# EAGLE design rpiInterface2 (EAGLE 9.4.2)
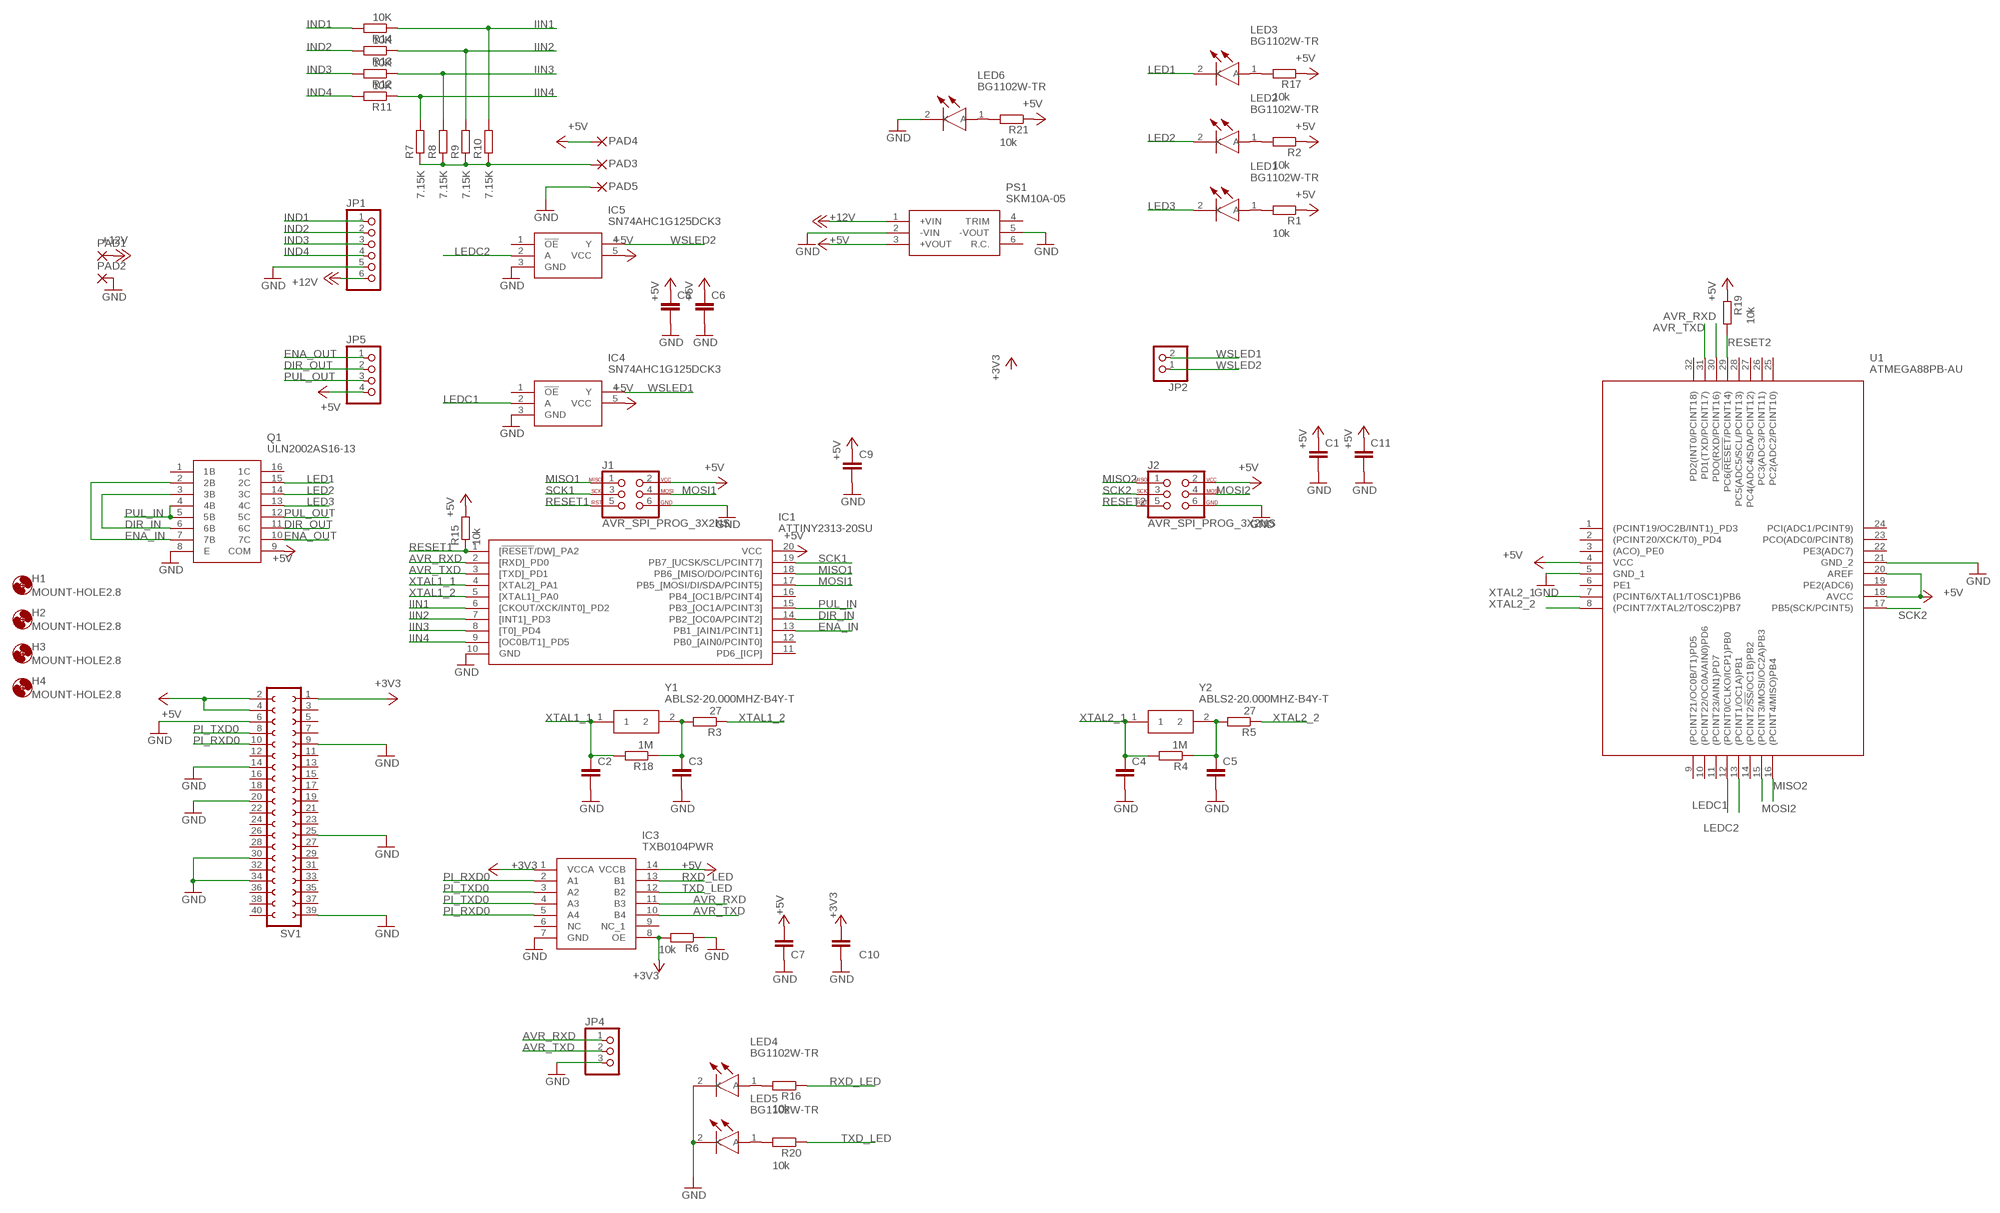
[diagram p0: schematic, sheet 1]

## Parts
C1  C-EUC1206  [C1206]
C2  C-EUC1206  [C1206]
C3  C-EUC1206  [C1206]
C4  C-EUC1206  [C1206]
C5  C-EUC1206  [C1206]
C6  C-EUC1206  [C1206]
C7  C-EUC1206  [C1206]
C8  C-EUC1206  [C1206]
C9  C-EUC1206  [C1206]
C10  C-EUC1206  [C1206]
C11  C-EUC1206  [C1206]
H1  MOUNT-HOLE2.8  [2,8]
H2  MOUNT-HOLE2.8  [2,8]
H3  MOUNT-HOLE2.8  [2,8]
H4  MOUNT-HOLE2.8  [2,8]
IC1  ATTINY2313-20SU  [SOIC127P1032X265-20N]
IC3  TXB0104PWR  [SOP65P640X120-14N]
IC4  SN74AHC1G125DCK3  [SOT65P210X110-5N]
IC5  SN74AHC1G125DCK3  [SOT65P210X110-5N]
J1  AVR_SPI_PROG_3X2NS  [2X3-NS]
J2  AVR_SPI_PROG_3X2NS  [2X3-NS]
JP1  PINHD-1X6  [1X06]
JP2  PINHD-1X2  [1X02]
JP4  PINHD-1X3  [1X03]
JP5  PINHD-1X4  [1X04]
LED1  BG1102W-TR  [BG1102WTR]
LED2  BG1102W-TR  [BG1102WTR]
LED3  BG1102W-TR  [BG1102WTR]
LED4  BG1102W-TR  [BG1102WTR]
LED5  BG1102W-TR  [BG1102WTR]
LED6  BG1102W-TR  [BG1102WTR]
PAD1  3,17/1,3  [3,17/1,3]
PAD2  3,17/1,3  [3,17/1,3]
PAD3  SMD2  [SMD1,27-2,54]
PAD4  SMD2  [SMD1,27-2,54]
PAD5  SMD2  [SMD1,27-2,54]
PS1  SKM10A-05  [SKM10A05]
Q1  ULN2002AS16-13  [SOIC127P605X126-16N]
R1  10k  R-EU_R1206  [R1206]
R2  10k  R-EU_R1206  [R1206]
R3  27  R-EU_R1206  [R1206]
R4  1M  R-EU_R1206  [R1206]
R5  27  R-EU_R1206  [R1206]
R6  10k  R-EU_R1206  [R1206]
R7  7.15K  R-EU_R1206  [R1206]
R8  7.15K  R-EU_R1206  [R1206]
R9  7.15K  R-EU_R1206  [R1206]
R10  7.15K  R-EU_R1206  [R1206]
R11  10K  R-EU_R1206  [R1206]
R12  10K  R-EU_R1206  [R1206]
R13  10K  R-EU_R1206  [R1206]
R14  10K  R-EU_R1206  [R1206]
R15  10k  R-EU_R1206  [R1206]
R16  10k  R-EU_R1206  [R1206]
R17  10k  R-EU_R1206  [R1206]
R18  1M  R-EU_R1206  [R1206]
R19  10k  R-EU_R1206  [R1206]
R20  10k  R-EU_R1206  [R1206]
R21  10k  R-EU_R1206  [R1206]
SV1  FE20-2  [FE20-2]
U1  ATMEGA88PB-AU  [QFP80P900X900X120-32N]
Y1  ABLS2-20.000MHZ-B4Y-T  [HC/49US-(AT49)_1]
Y2  ABLS2-20.000MHZ-B4Y-T  [HC/49US-(AT49)_1]

## Nets
+3V3: C10.1 IC3.1(VCCA) IC3.8(OE) R6.2 SV1.1
+5V: C1.1 C6.1 C7.1 C8.1 C9.1 C11.1 IC1.20(VCC) IC3.14(VCCB) IC4.5(VCC) IC5.5(VCC) J1.2 J2.2 JP5.4 PAD4.1(P) PS1.3(+VOUT) Q1.9(COM) R1.1 R2.1 R15.2 R17.1 R19.1 R21.1 SV1.2 SV1.4 U1.4(VCC) U1.18(AVCC) U1.20(AREF)
+12V: JP1.6 PAD1.1(P) PS1.1(+VIN)
AVR_RXD: IC1.2([RXD]_PD0) IC3.11(B3) JP4.1 U1.30(PDO(RXD/PCINT16))
AVR_TXD: IC1.3([TXD]_PD1) IC3.10(B4) JP4.2 U1.31(PD1(TXD/PCINT17))
DIR_IN: IC1.14(PB2_[OC0A/PCINT2]) Q1.3(3B) Q1.6(6B)
DIR_OUT: JP5.2 Q1.11(6C)
ENA_IN: IC1.13(PB1_[AIN1/PCINT1]) Q1.2(2B) Q1.7(7B)
ENA_OUT: JP5.1 Q1.10(7C)
GND: C1.2 C2.2 C3.2 C4.2 C5.2 C6.2 C7.2 C8.2 C9.2 C10.2 C11.2 IC1.10(GND) IC3.7(GND) IC4.3(GND) IC5.3(GND) J1.6 J2.6 JP1.5 JP4.3 LED4.2(K) LED5.2(K) LED6.2(K) PAD2.1(P) PAD5.1(P) PS1.2(-VIN) PS1.5(-VOUT) Q1.8(E) R6.1 SV1.6 SV1.9 SV1.14 SV1.20 SV1.25 SV1.30 SV1.34 SV1.39 U1.5(GND_1) U1.21(GND_2)
IIN1: IC1.6([CKOUT/XCK/INT0]_PD2) R10.2 R14.1
IIN2: IC1.7([INT1]_PD3) R9.2 R13.1
IIN3: IC1.8([T0]_PD4) R8.2 R12.1
IIN4: IC1.9([OC0B/T1]_PD5) R7.2 R11.1
IND1: JP1.1 R14.2
IND2: JP1.2 R13.2
IND3: JP1.3 R12.2
IND4: JP1.4 R11.2
LED1: LED3.2(K) Q1.15(2C)
LED2: LED2.2(K) Q1.14(3C)
LED3: LED1.2(K) Q1.13(4C)
LEDC1: IC4.2(A) U1.12((PCINT0/CLKO/ICP1)PB0)
LEDC2: IC5.2(A) U1.13((PCINT1/OC1A)PB1)
MISO1: IC1.18(PB6_[MISO/DO/PCINT6]) J1.1
MISO2: J2.1 U1.16((PCINT4/MISO)PB4)
MOSI1: IC1.17(PB5_[MOSI/DI/SDA/PCINT5]) J1.4
MOSI2: J2.4 U1.15((PCINT3/MOSI/OC2A)PB3)
N$1: C3.1 R3.2 R18.1 Y1.2
N$2: C5.1 R4.1 R5.2 Y2.2
N$3: LED1.1(A) R1.2
N$4: LED2.1(A) R2.2
N$5: LED3.1(A) R17.2
N$6: LED4.1(A) R16.2
N$7: LED5.1(A) R20.2
N$8: PAD3.1(P) R7.1 R8.1 R9.1 R10.1
N$9: LED6.1(A) R21.2
PI_RXD0: IC3.2(A1) IC3.5(A4) SV1.10
PI_TXD0: IC3.3(A2) IC3.4(A3) SV1.8
PUL_IN: IC1.15(PB3_[OC1A/PCINT3]) Q1.4(4B) Q1.5(5B)
PUL_OUT: JP5.3 Q1.12(5C)
RESET1: IC1.1([!RESET!/DW]_PA2) J1.5 R15.1
RESET2: J2.5 R19.2 U1.29(PC6(!RESET!/PCINT14))
RXD_LED: IC3.13(B1) R16.1
SCK1: IC1.19(PB7_[UCSK/SCL/PCINT7]) J1.3
SCK2: J2.3 U1.17(PB5(SCK/PCINT5))
TXD_LED: IC3.12(B2) R20.1
WSLED1: IC4.4(Y) JP2.2
WSLED2: IC5.4(Y) JP2.1
XTAL1_1: C2.1 IC1.4([XTAL2]_PA1) R18.2 Y1.1
XTAL1_2: IC1.5([XTAL1]_PA0) R3.1
XTAL2_1: C4.1 R4.2 U1.7((PCINT6/XTAL1/TOSC1)PB6) Y2.1
XTAL2_2: R5.1 U1.8((PCINT7/XTAL2/TOSC2)PB7)
Unconnected: IC1.11(PD6_[ICP]) IC1.12(PB0_[AIN0/PCINT0]) IC1.16(PB4_[OC1B/PCINT4]) IC3.6(NC) IC3.9(NC_1) IC4.1(!OE) IC5.1(!OE) PS1.4(TRIM) PS1.6(R.C.) Q1.1(1B) Q1.16(1C) SV1.3 SV1.5 SV1.7 SV1.11 SV1.12 SV1.13 SV1.15 SV1.16 SV1.17 SV1.18 SV1.19 SV1.21 SV1.22 SV1.23 SV1.24 SV1.26 SV1.27 SV1.28 SV1.29 SV1.31 SV1.32 SV1.33 SV1.35 SV1.36 SV1.37 SV1.38 SV1.40 U1.1((PCINT19/OC2B/INT1)_PD3) U1.2((PCINT20/XCK/T0)_PD4) U1.3((ACO)_PE0) U1.6(PE1) U1.9((PCINT21/OC0B/T1)PD5) U1.10((PCINT22/OC0A/AIN0)PD6) U1.11((PCINT23/AIN1)PD7) U1.14((PCINT2/!SS!/OC1B)PB2) U1.19(PE2(ADC6)) U1.22(PE3(ADC7)) U1.23(PCO(ADC0/PCINT8)) U1.24(PCI(ADC1/PCINT9)) U1.25(PC2(ADC2/PCINT10)) U1.26(PC3(ADC3/PCINT11)) U1.27(PC4(ADC4/SDA/PCINT12)) U1.28(PC5(ADC5/SCL/PCINT13)) U1.32(PD2(INT0/PCINT18))

## Library data of the parts
C1-C11 = rcl:C-EU: CAPACITOR, European symbol; SPICEPREFIX: C
H1-H4 = holes:MOUNT-HOLE: MOUNTING HOLE with drill center marker
IC1 = SamacSys_Parts:ATTINY2313-20SU: ATTINY2313-20SU, 8 bit AVR Microcontroller 20MHz 2, 128kB, B Flash, 128B RAM, I2C SPI 20-Pin SOIC Source: Datasheet <https://componentsearchengine.com/Datasheets/1/ATTINY2313-20SU.pdf>; DESCRIPTION: ATTINY2313-20SU, 8 bit AVR Microcontroller 20MHz 2, 128kB, B Flash, 128B RAM, I2C SPI 20-Pin SOIC; HEIGHT: 2.65mm; MANUFACTURER_NAME: Microchip; MANUFACTURER_PART_NUMBER: ATTINY2313-20SU; MOUSER_PART_NUMBER: 556-ATTINY2313-20SU; MOUSER_PRICE-STOCK: https://www.mouser.com/Search/Refine.aspx?Keyword=556-ATTINY2313-20SU
IC3 = SamacSys_Parts:TXB0104PWR: 4-Bit Bidirectional Voltage-Level Shifter with Auto Direction Sensing and +/-15 kV ESD Protect Source: Datasheet <http://www.ti.com/lit/ds/symlink/txb0104.pdf>; DESCRIPTION: 4-Bit Bidirectional Voltage-Level Shifter with Auto Direction Sensing and +/-15 kV ESD Protect; HEIGHT: 1.2mm; MANUFACTURER_NAME: Texas Instruments; MANUFACTURER_PART_NUMBER: TXB0104PWR; MOUSER_PART_NUMBER: 595-TXB0104PWR; MOUSER_PRICE-STOCK: https://www.mouser.com/Search/Refine.aspx?Keyword=595-TXB0104PWR
IC4 IC5 = SamacSys_Parts:SN74AHC1G125DCK3: Buffers & Line Drivers SN74AHC1G125DCK3 Source: Datasheet <http://www.ti.com/lit/ds/symlink/sn74ahc1g125.pdf>; DESCRIPTION: Buffers & Line Drivers SN74AHC1G125DCK3; HEIGHT: 1.1mm; MANUFACTURER_NAME: Texas Instruments; MANUFACTURER_PART_NUMBER: SN74AHC1G125DCK3; MOUSER_PART_NUMBER: 595-SN74AHC1G125DCK3; MOUSER_PRICE-STOCK: https://www.mouser.com/Search/Refine.aspx?Keyword=595-SN74AHC1G125DCK3
J1 J2 = SparkFun-Connectors:AVR_SPI_PROG_3X2: AVR ISP 6 Pin This is the reduced ISP connector for AVR programming. Common on Arduino. This footprint will take up less PCB space and can be used with a 10-pin to 6-pin adapter such as SKU: BOB-08508 **Special note about "TEST_POINT" package. The stop mask is on the top side, so if you want your programming test points to be on the bottom of your board, make sure to place this package on the bottom side of the board. This also ensure that the orientation to program from the bottom side will be correct. SparkFun Products: SparkFun ISP Pogo Adapter <https://www.sparkfun.com/products/11591> - NS Tiny AVR Programmer <https://www.sparkfun.com/products/11801> -PTH
JP1 = pinhead:PINHD-1X6: PIN HEADER
JP2 = pinhead:PINHD-1X2: PIN HEADER
JP4 = pinhead:PINHD-1X3: PIN HEADER
JP5 = pinhead:PINHD-1X4: PIN HEADER
LED1-LED6 = SamacSys_Parts:BG1102W-TR: Stanley Electric 1102W 558 nm Green LED, 3216 (1206) SMD package Source: Datasheet <https://media.digikey.com/pdf/Data Sheets/Stanley Electric PDFs/1102W_Series.pdf>; DESCRIPTION: Stanley Electric 1102W 558 nm Green LED, 3216 (1206) SMD package; HEIGHT: 1mm; MANUFACTURER_NAME: Stanley Electric; MANUFACTURER_PART_NUMBER: BG1102W-TR; MOUSER_PART_NUMBER: 327-BG1102WTR; MOUSER_PRICE-STOCK: https://www.mouser.com/Search/Refine.aspx?Keyword=327-BG1102WTR
PAD1 PAD2 = wirepad:3,17/1,3: THROUGH-HOLE PAD
PAD3-PAD5 = wirepad:SMD2: SMD PAD
PS1 = SamacSys_Parts:SKM10A-05: Isolated DC/DC Converters 9-18Vin 5Vout 2000mA DIP Iso Reg Source: Datasheet <https://www.arrow.com/en/products/skm10a-05/mean-well-enterprises>; DESCRIPTION: Isolated DC/DC Converters 9-18Vin 5Vout 2000mA DIP Iso Reg; HEIGHT: 10.7mm; MANUFACTURER_NAME: Mean Well; MANUFACTURER_PART_NUMBER: SKM10A-05; MOUSER_PART_NUMBER: 709-SKM10A-05; MOUSER_PRICE-STOCK: https://www.mouser.com/Search/Refine.aspx?Keyword=709-SKM10A-05
Q1 = SamacSys_Parts:ULN2002AS16-13: Darlington Transistors High Volt Darlington 7Drivers 500mA 250ns Source: Datasheet <https://componentsearchengine.com/Datasheets/1/ULN2002AS16-13.pdf>; DESCRIPTION: Darlington Transistors High Volt Darlington 7Drivers 500mA 250ns; HEIGHT: 1.26mm; MANUFACTURER_NAME: Diodes Inc.; MANUFACTURER_PART_NUMBER: ULN2002AS16-13; MOUSER_PART_NUMBER: 621-ULN2002AS16-13; MOUSER_PRICE-STOCK: https://www.mouser.com/Search/Refine.aspx?Keyword=621-ULN2002AS16-13
R1-R21 = rcl:R-EU_: RESISTOR, European symbol; SPICEPREFIX: R
SV1 = con-lsta:FE20-2: FEMALE HEADER; OC_FARNELL: unknown; OC_NEWARK: unknown
U1 = SamacSys_Parts:ATMEGA88PB-AU: AVR, 8KB FLASH, 512B EE, 1KB SRAM, TQFP Atmel ATMEGA88PB-AU, 8bit AVR Microcontroller, 20MHz, 8 kB Flash, 32-Pin TQFP Source: Datasheet <https://componentsearchengine.com/Datasheets/1/ATMEGA88PB-AU.pdf>; DESCRIPTION: AVR, 8KB FLASH, 512B EE, 1KB SRAM, TQFP Atmel ATMEGA88PB-AU, 8bit AVR Microcontroller, 20MHz, 8 kB Flash, 32-Pin TQFP; HEIGHT: 1.2mm; MANUFACTURER_NAME: Microchip; MANUFACTURER_PART_NUMBER: ATMEGA88PB-AU; MOUSER_PART_NUMBER: 556-ATMEGA88PB-AU; MOUSER_PRICE-STOCK: https://www.mouser.com/Search/Refine.aspx?Keyword=556-ATMEGA88PB-AU
Y1 Y2 = SamacSys_Parts:ABLS2-20.000MHZ-B4Y-T: Crystals 20.000MHZ, 18pF 30ppm -20C +70C Source: Datasheet <https://componentsearchengine.com/Datasheets/1/ABLS2-20.000MHz-B4Y-T.pdf>; DESCRIPTION: Crystals 20.000MHZ, 18pF 30ppm -20C +70C; HEIGHT: mm; MANUFACTURER_NAME: ABRACON; MANUFACTURER_PART_NUMBER: ABLS2-20.000MHz-B4Y-T; MOUSER_PART_NUMBER: 815-ABLS2-20-B4YT; MOUSER_PRICE-STOCK: https://www.mouser.com/Search/Refine.aspx?Keyword=815-ABLS2-20-B4YT

## Board
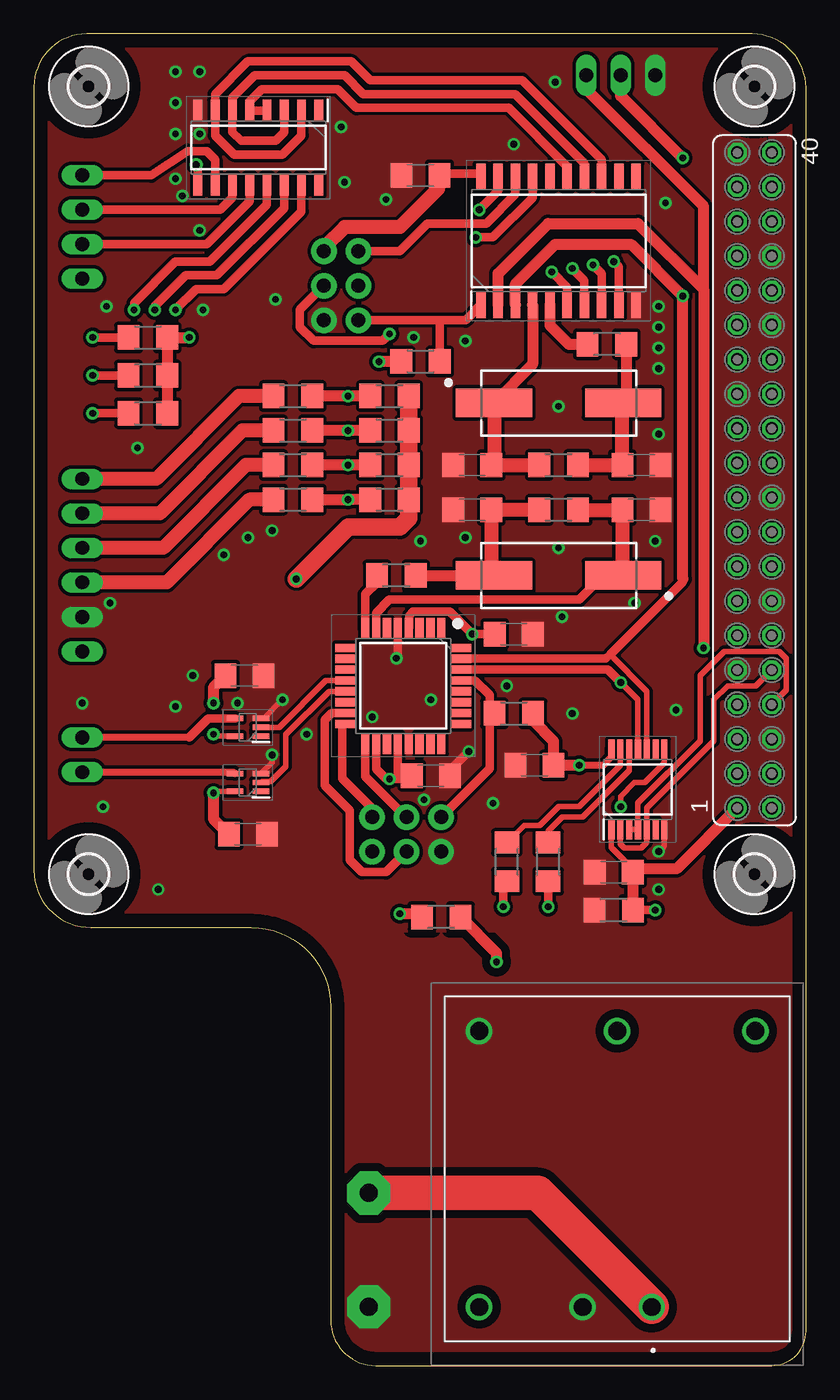
[diagram p1: board, top side]
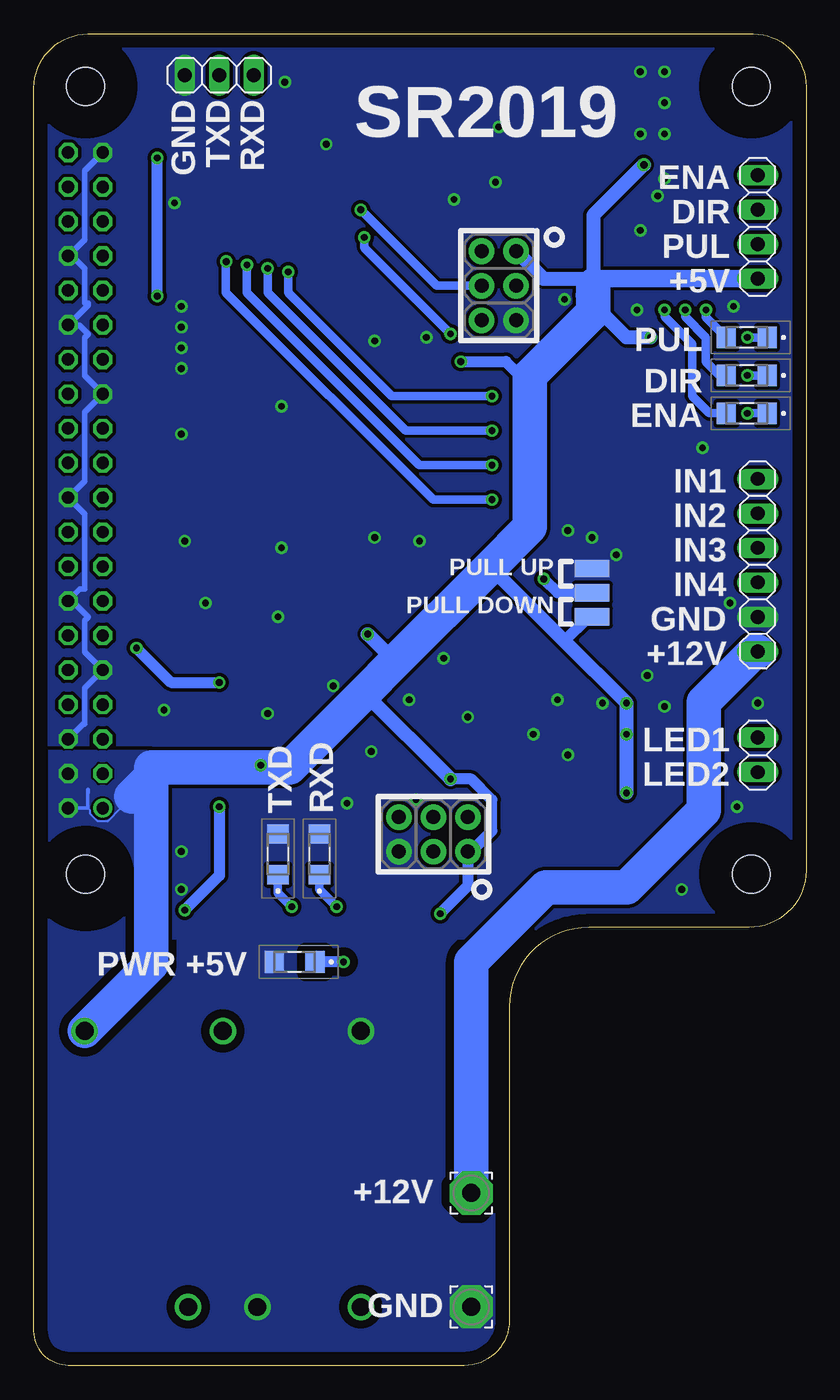
[diagram p2: board, bottom side, seen from below]

Size 56.82 x 98.03 mm. Coordinates in mm from the lower left corner, seen from the top.
Outline: 21.84,26.42 21.84,3.3 arc90 25.15,0 54.28,0 arc90 56.82,2.54 56.82,94.08 arc90 52.86,98.03 3.88,98.03 arc90 0,94.16 0,36.44 arc90 4.19,32.26 16,32.26 arc-90 21.84,26.42
Copper layers (1*16): Top 0.035mm / dielectric 1.5mm / Bottom 0.035mm
Design rules "default *": minimum track width 6mil, minimum drill 0.35mm, track to track 6mil, track to pad 6mil, pad to pad 6mil, via to via 6mil, smd to smd 6mil, copper to edge 40mil, drill to drill 6mil, minimum pad ring 10mil, minimum via ring 8mil, stop-mask expansion 4mil, vias tented up to drill 50mil, thermal gap 10mil

### Footprints (pad centres in the part's own frame; a part is rotated, then mirrored left to right if it is on the bottom)
C1206 = smd 1.6 x 1.8: 1 -1.4,0; 2 1.4,0
2,8 = hole 2.8: 0,0
SOIC127P1032X265-20N = smd 1.925 x 0.7: 1 -4.712,5.715; 2 -4.712,4.445; 3 -4.712,3.175; 4 -4.712,1.905; 5 -4.712,0.635; 6 -4.712,-0.635; 7 -4.712,-1.905; 8 -4.712,-3.175; 9 -4.712,-4.445; 10 -4.712,-5.715; 11 4.712,-5.715; 12 4.712,-4.445; 13 4.712,-3.175; 14 4.712,-1.905; 15 4.712,-0.635; 16 4.712,0.635; 17 4.712,1.905; 18 4.712,3.175; 19 4.712,4.445; 20 4.712,5.715
SOP65P640X120-14N = smd 1.475 x 0.45: 1 -2.938,1.95; 2 -2.938,1.3; 3 -2.938,0.65; 4 -2.938,0; 5 -2.938,-0.65; 6 -2.938,-1.3; 7 -2.938,-1.95; 8 2.938,-1.95; 9 2.938,-1.3; 10 2.938,-0.65; 11 2.938,0; 12 2.938,0.65; 13 2.938,1.3; 14 2.938,1.95
SOT65P210X110-5N = smd 1.2 x 0.4: 1 -0.95,0.65; 2 -0.95,0; 3 -0.95,-0.65; 4 0.95,-0.65; 5 0.95,0.65
2X3-NS = drill 1.016 pad 1.88: 1 -2.54,-1.27; 2 -2.54,1.27; 3 0,-1.27; 4 0,1.27; 5 2.54,-1.27; 6 2.54,1.27
1X06 = drill 1.016 long: 1 -6.35,0; 2 -3.81,0; 3 -1.27,0; 4 1.27,0; 5 3.81,0; 6 6.35,0
1X02 = drill 1.016 long: 1 -1.27,0; 2 1.27,0
1X03 = drill 1.016 long: 1 -2.54,0; 2 0,0; 3 2.54,0
1X04 = drill 1.016 long: 1 -3.81,0; 2 -1.27,0; 3 1.27,0; 4 3.81,0
BG1102WTR = smd 1.6 x 1.4: 1 0,1.2; 2 0,-1.8
3,17/1,3 = drill 1.321 pad 3.175 octagon: 1 0,0
SMD1,27-2,54 = smd 1.27 x 2.54: 1 0,0
SKM10A05 = drill 1.3 pad 1.95: 1 0,0; 2 -5.08,0; 3 7.62,20.32; 4 -2.54,20.32; 5 -12.7,20.32; 6 -12.7,0
SOIC127P605X126-16N = smd 1.575 x 0.65: 1 -2.738,4.445; 2 -2.738,3.175; 3 -2.738,1.905; 4 -2.738,0.635; 5 -2.738,-0.635; 6 -2.738,-1.905; 7 -2.738,-3.175; 8 -2.738,-4.445; 9 2.738,-4.445; 10 2.738,-3.175; 11 2.738,-1.905; 12 2.738,-0.635; 13 2.738,0.635; 14 2.738,1.905; 15 2.738,3.175; 16 2.738,4.445
R1206 = smd 1.6 x 1.803: 1 -1.422,0; 2 1.422,0
FE20-2 = drill 0.914: 1 -24.13,1.27 | drill 0.914 octagon: 2 -24.13,-1.27; 3 -21.59,1.27; 4 -21.59,-1.27; 5 -19.05,1.27; 6 -19.05,-1.27; 7 -16.51,1.27; 8 -16.51,-1.27; 9 -13.97,1.27; 10 -13.97,-1.27; 11 -11.43,1.27; 12 -11.43,-1.27; 13 -8.89,1.27; 14 -8.89,-1.27; 15 -6.35,1.27; 16 -6.35,-1.27; 17 -3.81,1.27; 18 -3.81,-1.27; 19 -1.27,1.27; 20 -1.27,-1.27; 21 1.27,1.27; 22 1.27,-1.27; 23 3.81,1.27; 24 3.81,-1.27; 25 6.35,1.27; 26 6.35,-1.27; 27 8.89,1.27; 28 8.89,-1.27; 29 11.43,1.27; 30 11.43,-1.27; 31 13.97,1.27; 32 13.97,-1.27; 33 16.51,1.27; 34 16.51,-1.27; 35 19.05,1.27; 36 19.05,-1.27; 37 21.59,1.27; 38 21.59,-1.27; 39 24.13,1.27; 40 24.13,-1.27
QFP80P900X900X120-32N = smd 1.5 x 0.6: 1 -4.25,2.8; 2 -4.25,2; 3 -4.25,1.2; 4 -4.25,0.4; 5 -4.25,-0.4; 6 -4.25,-1.2; 7 -4.25,-2; 8 -4.25,-2.8; 17 4.25,-2.8; 18 4.25,-2; 19 4.25,-1.2; 20 4.25,-0.4; 21 4.25,0.4; 22 4.25,1.2; 23 4.25,2; 24 4.25,2.8 | smd 0.6 x 1.5: 9 -2.8,-4.25; 10 -2,-4.25; 11 -1.2,-4.25; 12 -0.4,-4.25; 13 0.4,-4.25; 14 1.2,-4.25; 15 2,-4.25; 16 2.8,-4.25; 25 2.8,4.25; 26 2,4.25; 27 1.2,4.25; 28 0.4,4.25; 29 -0.4,4.25; 30 -1.2,4.25; 31 -2,4.25; 32 -2.8,4.25
HC/49US-(AT49)_1 = smd 5.6 x 2.1: 1 -4.75,0; 2 4.75,0

### Placement (x,y rotation side)
C1  36.83,44.2 180 top
C2  32.26,66.29 180 top
C3  44.7,66.29 0 top
C4  44.7,62.99 0 top
C5  32.26,62.99 180 top
C6  15.75,39.12 0 top
C7  29.21,43.43 0 top
C8  15.49,50.8 0 top
C9  28.45,87.63 180 top
C10  42.67,36.32 180 top
C11  35.31,53.85 0 top
H1  4.03,36.17 0 top
H2  53.03,36.17 0 top
H3  4.03,94.17 0 top
H4  53.03,94.17 0 top
IC1  38.61,82.8 90 top
IC3  44.45,42.42 90 top
IC4  15.75,46.99 180 top
IC5  15.75,42.93 180 top
J1  22.61,79.5 270 bottom
J2  27.43,39.12 180 bottom
JP1  3.56,58.93 270 bottom
JP2  3.56,44.96 90 bottom
JP4  43.18,95 180 bottom
JP5  3.56,83.82 270 bottom
LED1  4.06,75.69 270 bottom
LED2  4.06,72.9 270 bottom
LED3  4.06,70.1 270 bottom
LED4  35.81,37.34 180 bottom
LED5  38.86,37.34 180 bottom
LED6  37.34,29.72 270 bottom
PAD1  24.64,12.7 0 bottom
PAD2  24.64,4.32 0 bottom
PAD3  15.75,56.9 270 bottom
PAD4  15.75,55.12 270 bottom
PAD5  15.75,58.67 270 bottom
PS1  45.47,4.32 0 top
Q1  16.51,89.66 270 top
R1  8.38,75.69 180 top
R2  8.38,72.9 180 top
R3  42.16,75.18 0 top
R4  38.61,62.99 0 top
R5  26.67,58.17 0 top
R6  42.67,33.53 0 top
R7  26.16,63.75 180 top
R8  26.16,66.29 180 top
R9  26.16,68.83 180 top
R10  26.16,71.37 180 top
R11  19.05,63.75 180 top
R12  19.05,66.29 180 top
R13  19.05,68.83 180 top
R14  19.05,71.37 180 top
R15  28.45,73.91 180 top
R16  34.8,37.08 270 top
R17  8.38,70.1 180 top
R18  38.61,66.29 180 top
R19  35.31,48.01 180 top
R20  37.85,37.08 270 top
R21  29.97,33.02 0 top
SV1  53.03,65.17 90 top
U1  27.18,50.04 270 top
Y1  38.61,70.87 0 top
Y2  38.61,58.17 180 top

### Tracks (layer width: path | path; a pad name or v marks a point on that pad's centre or on a via)
+3V3  (via drill 0.5)
  Top 0.406: IC3.1 42.5,38.16 43.83,36.83 44.07,36.83 44.07,36.58 C10.1 | IC3.8 46.4,44.37 44.96,42.93 44.2,42.93 43.18,41.91 v43.18,41.15
  Top 0.61: v45.72,33.53 R6.2
  Top 0.813: C10.1 44.07,33.55 R6.2 | SV1.1 47.29,36.58 44.07,36.58
  Bottom 0.813: v43.18,41.15 43.18,36.07 v45.72,33.53
+5V  (via drill 0.5, 0.55)
  Top 0.406: IC5.5 13.32,42.28 v13.21,42.16 | IC4.5 13.35,46.34 v13.21,46.48
  Top 0.508: IC3.14 42.5,44.79 41.91,44.2 v40.13,44.2
  Top 0.61: C9.1 29.97,87.75 32.66,87.75 IC1.20 | Q1.9 12.06,88.27 v11.94,88.39 | U1.18 25.18,43.91 25.91,43.18 v26.16,43.18 26.79,43.18 | 26.79,43.18 27.56,43.18 C7.1 | U1.20 26.78,43.2 26.79,43.18 | U1.4 27.62,54.33 27.62,55.23 27.89,55.49 30.61,55.49 v32.26,53.85 C11.1
  Top 0.813: R17.1 R2.1 R1.1 v11.43,75.69 | C8.1 13.21,49.91 v13.21,48.77 | v13.21,42.16 13.21,40.26 C6.1 | R19.1 36.73,47.48 38.23,45.97 C1.1 v40.13,44.2 | R15.2 v25.4,73.91 | v26.92,33.27 28.3,33.27 R21.1
  Top 1.016: C9.1 29.72,86.61 26.92,83.82 22.86,83.82 21.34,82.3 J1.2
  Bottom 0.152: 49.64,41.91 48.78,41.04 50.43,41.04 51.37,40.1 52.15,40.1 52.7,40.66 52.7,40.89 52.85,41.04
  Bottom 0.254: SV1.2 52.85,41.04 52.85,42.14 | 52.85,42.14 52.83,42.14 52.83,42.42 | 52.85,42.14 52.85,42.42
  Bottom 0.406: 47.51,44.04 48.2,44.04
  Bottom 0.813: v25.4,73.91 22.1,73.91 20.32,72.14 | 17.78,53.34 16,55.12 PAD4.1 | v26.92,33.27 24.89,35.31 J2.2 24.64,37.85 23.11,39.37 23.11,41.66 24.64,43.18 v26.16,43.18 | v40.13,44.2 39.98,44.04 38,44.04
  Bottom 1.016: 16.33,78.82 13.21,75.69 v11.43,75.69 | v32.26,53.85 30.23,51.82 | 32.51,49.53 v26.16,43.18 | J1.2 19.3,80.01 15.14,80.01 15.65,79.5 15.65,84.68 v11.94,88.39 | v13.21,42.16 v13.21,46.48 v13.21,48.77 17.78,53.34 23.11,58.67 23.37,58.67
  Bottom 1.27: JP5.4 15.14,80.01 16.33,78.82
  Bottom 2.54: PS1.3 48.2,29.52 48.2,44.04 38,44.04 32.51,49.53 30.23,51.82 23.37,58.67 20.32,61.72 20.32,72.14 20.32,72.9 15.65,77.57 15.65,79.5 | 49.64,41.91 47.51,44.04
  pour Bottom (no thermals): 48.51,45.21 55.88,45.21 55.88,36.83 48.51,36.83
+12V
  Top 2.54: PS1.1 37.08,12.7 PAD1.1
  Bottom 2.54: JP1.6 3.81,52.58 7.52,48.87 7.52,40.88 13.19,35.21 19.15,35.21 24.64,29.72 PAD1.1
AVR_RXD  (via drill 0.5)
  Top 0.406: IC3.11 44.45,49.02 v43.18,50.29
  Top 0.61: U1.30 42.23,51.24 v43.18,50.29
  Top 0.813: IC1.2 34.16,80.39 37.85,84.07 44.45,84.07 49.28,79.25 | 49.28,79.25 v49.28,52.83 | 49.28,79.25 49.28,85.34 40.64,93.98 JP4.1
  Bottom 0.813: v43.18,50.29 46.74,50.29 v49.28,52.83
AVR_TXD  (via drill 0.5)
  Top 0.406: 42.4,52.34 45.1,49.64 IC3.10 | 47.75,57.69 47.75,57.91
  Top 0.61: 47.75,57.69 42.4,52.34 42.1,52.04 U1.31
  Top 0.813: IC1.3 35.43,79.63 38.35,82.55 43.94,82.55 v47.75,78.74 47.75,57.91 | v47.75,88.9 43.18,93.47 JP4.2
  Bottom 0.813: v47.75,78.74 v47.75,88.9
DIR_IN
  Top 0.61: IC1.14 40.51,88.53 35.43,93.61 24.24,93.61 22.86,95 16.26,95 14.6,93.35 Q1.6 14.6,90.81 15.24,90.17 17.78,90.17 18.41,90.81 Q1.3
DIR_OUT
  Top 0.61: Q1.11 14.6,85.98 13.72,85.09 JP5.2
ENA_IN
  Top 0.61: IC1.13 41.78,88.79 35.94,94.63 24.75,94.63 23.37,96.01 15.75,96.01 13.33,93.6 Q1.7 13.33,90.55 14.73,89.15 18.29,89.15 19.69,90.55 Q1.2
ENA_OUT
  Top 0.61: Q1.10 13.33,88.77 12.7,89.41 11.3,89.41 8.64,87.63 JP5.1
GND  (via drill 0.5)
  Top 0.406: IC5.3 17.53,44.4 v17.53,44.96 | IC4.3 16.91,47.64 v18.29,49.02 | IC3.7 46.4,38.27 v45.97,37.85
  Top 0.61: C7.2 30.61,43.82 v32,45.21 | U1.5 26.78,52.18 v26.67,52.07
  Bottom 0.406: SV1.6 53.18,47.24 53.09,47.24 53.09,49.88 SV1.9 53.09,52.53 53.09,54.86 52.83,55.12 54,56.28 SV1.14 53.43,57.15 53.09,57.15 53.09,62.69 SV1.20 53.09,65.12 53.09,70.2 SV1.25 51.76,71.57 53.09,72.9 53.09,75.69 52.83,75.95 53.49,76.6 SV1.30 52.83,78.07 52.83,78.23 53.09,78.23 53.09,80.77 54,81.68 SV1.34 53.09,82.9 53.09,87.98 SV1.39
  other vias: 35.31,89.92 10.92,86.11 10.41,87.38 22.61,91.19 22.86,87.12 12.19,83.57 14.99,48.77 10.41,48.51 11.68,50.8 17.78,78.49 12.45,77.72 7.62,67.56 5.33,77.98 12.19,90.68 46.48,85.6 38.61,70.61 45.97,77.98 45.97,76.45 45.97,74.93 45.97,73.41 9.14,35.05 5.08,41.15 3.56,48.77 47.24,48.26 38.35,94.49 34.8,50.04 39.62,48.01 45.97,35.05 24.89,47.75 38.86,55.12 44.2,56.13 38.61,60.2 31.75,60.96 28.45,60.71 45.72,60.71 45.97,68.58 20.07,46.48 28.7,41.66 5.59,56.13 13.97,59.69 15.75,60.96 17.53,61.47 25.91,85.85 31.75,75.44 27.94,75.69 29.21,49.02 33.78,41.4 10.41,90.68 10.41,92.96 10.41,95.25 12.19,95.25
  pour Top (isolate 0.254, no thermals): -1.02,99.06 58.67,99.06 58.67,32 -1.02,32
  pour Bottom (isolate 0.254, no thermals): -2.54,100.33 57.4,100.33 57.4,45.72 48.01,45.72 48.01,36.32 57.15,36.32 57.15,31.48 -2.54,31.48
  pour Top (isolate 0.61, no thermals): 57.15,0 57.15,33.27 17.27,33.27 17.27,0
  pour Bottom (isolate 0.61, no thermals): 21.84,-0.51 57.66,-0.51 57.66,34.04 21.84,34.04
IIN1  (via drill 0.5)
  Top 0.61: IC1.6 39.24,79.38 v38.1,80.52
  Top 0.813: R14.1 v23.11,71.37 R10.2
  Bottom 0.61: v38.1,80.52 38.1,78.99 30.48,71.37 v23.11,71.37
IIN2  (via drill 0.5)
  Top 0.61: IC1.7 40.51,79.88 v39.62,80.77
  Top 0.813: R13.1 v23.11,68.83 R9.2
  Bottom 0.61: v39.62,80.77 39.62,78.99 29.46,68.83 v23.11,68.83
IIN3  (via drill 0.5)
  Top 0.61: IC1.8 41.78,80.39 v41.15,81.03
  Top 0.813: R12.1 v23.11,66.29 R8.2
  Bottom 0.61: v41.15,81.03 41.15,78.99 28.45,66.29 v23.11,66.29
IIN4  (via drill 0.5)
  Top 0.61: IC1.9 43.05,80.9 v42.67,81.28
  Top 0.813: R11.1 v23.11,63.75 R7.2
  Bottom 0.61: v42.67,81.28 42.69,81.26 42.69,78.99 27.45,63.75 v23.11,63.75
IND1
  Top 1.016: R14.2 15.09,71.37 8.99,65.28 JP1.1
IND2
  Top 1.016: R13.2 15.34,68.83 9.25,62.74 JP1.2
IND3
  Top 1.016: R12.2 15.6,66.29 9.5,60.2 JP1.3
IND4
  Top 1.016: R11.2 15.85,63.75 9.75,57.66 JP1.4
LED1  (via drill 0.5)
  Top 0.61: v10.41,77.72 11.94,79.25 13.97,79.25 19.69,84.96 Q1.15
  Bottom 0.61: v10.41,77.72 10.41,77.22 8.38,75.18 8.38,71.37 7.11,70.1 LED3.2
LED2  (via drill 0.5)
  Top 0.61: v8.89,77.72 8.89,77.98 11.18,80.26 13.46,80.26 18.41,85.22 Q1.14
  Bottom 0.61: v8.89,77.72 8.89,77.22 7.37,75.69 7.37,73.91 6.35,72.9 LED2.2
LED3  (via drill 0.5)
  Top 0.61: v7.37,77.72 7.37,78.23 10.41,81.28 12.95,81.28 17.14,85.47 Q1.13
  Bottom 0.61: LED1.2 7.37,77.19 v7.37,77.72
LEDC1
  Top 0.406: IC4.2 18.03,46.99 21.48,50.44 U1.12
LEDC2
  Top 0.406: IC5.2 16.79,43.02 17.44,43.02 18.54,44.12 18.54,46.45 21.73,49.64 U1.13
MISO1
  Top 0.61: IC1.18 35.43,86.23 33.27,84.07 28.96,84.07 26.92,82.04 J1.1
MISO2
  Top 0.61: J2.1 24.89,41.01 22.67,43.23 22.67,47.24 U1.16
MOSI1  (via drill 0.5)
  Top 0.61: IC1.17 36.7,85.98 33.78,83.06 v32.51,83.06 | J1.4 19.56,77.72 19.56,76.45 20.57,75.44 25.65,75.44 v26.16,75.95
  Bottom 0.61: v32.51,83.06 32.51,82.3 v26.16,75.95
MOSI2
  Top 0.61: U1.15 21.91,48.04 21.4,47.53 21.4,42.7 23.25,40.86 23.25,37.21 24.13,36.32 25.91,36.32 J2.4
N$1
  Top 0.61: Y1.2 43.59,70.64 43.59,70.46
  Top 0.813: R3.2 43.59,70.46
  Top 1.016: R18.1 C3.1 43.3,70.81 Y1.2
N$2
  Top 0.813: R5.2 Y2.2
  Top 1.016: R4.1 C5.1 33.66,58.37 Y2.2
N$3  (via drill 0.5)
  Top 0.61: v4.32,75.69 R1.2
  Bottom 0.61: LED1.1 v4.32,75.69
N$4  (via drill 0.5)
  Top 0.61: v4.32,72.9 R2.2
  Bottom 0.61: LED2.1 v4.32,72.9
N$5  (via drill 0.5)
  Top 0.61: v4.32,70.1 R17.2
  Bottom 0.61: LED3.1 v4.32,70.1
N$6  (via drill 0.5)
  Top 0.61: R16.2 34.54,35.41 v34.54,33.78
  Bottom 0.61: LED4.1 35.81,35.05 v34.54,33.78
N$7  (via drill 0.5)
  Top 0.61: R20.2 v37.85,33.78
  Bottom 0.61: LED5.1 38.86,34.8 v37.85,33.78
N$8  (via drill 0.5)
  Top 1.27: R10.1 R9.1 R8.1 R7.1 27.58,62.38 26.92,61.72 23.11,61.72 v19.3,57.91
  Bottom 0.813: v19.3,57.91 18.29,56.9 PAD3.1
N$9  (via drill 0.5)
  Top 0.813: R21.2 34.04,30.38 v34.04,29.72
  Bottom 0.813: v34.04,29.72 LED6.1
PI_RXD0
  Top 0.406: SV1.10 53.13,50.04 51.05,50.04 50.04,49.02 50.04,45.97 45.1,41.04 IC3.5 45.1,38.5 44.7,38.1 43.43,38.1 43.15,38.38 IC3.2
PI_TXD0
  Top 0.406: SV1.8 55.37,49.74 55.37,52.07 54.86,52.58 50.8,52.58 49.02,50.8 49.02,45.97 44.45,41.4 IC3.4 IC3.3
PUL_IN
  Top 0.61: IC1.15 39.24,88.28 34.93,92.6 23.74,92.6 22.35,93.98 16.76,93.98 15.87,93.09 Q1.5 Q1.4
PUL_OUT
  Top 0.61: Q1.12 15.87,85.73 12.7,82.55 JP5.3
RESET1
  Top 0.61: IC1.1 31.76,76.96 29.97,76.96 | 29.97,76.96 J1.5 | R15.1 29.87,76.86 29.97,76.96
RESET2
  Top 0.406: R19.2 33.53,48.36 33.53,49.35
  Top 0.61: U1.29 32.44,50.44 33.53,49.35 33.53,43.94 J2.5
RXD_LED
  Top 0.406: IC3.13 43.15,44.17 40.13,41.15 38.61,41.15 37.24,39.78 36.07,39.78 R16.1
SCK1  (via drill 0.5)
  Top 0.61: IC1.19 34.16,86.49 v32.77,85.09
  Bottom 0.61: J1.3 27.18,79.5 v32.77,85.09
SCK2
  Top 0.61: J2.3 27.36,40.39 24.38,43.37 U1.17
TXD_LED
  Top 0.406: IC3.12 43.8,43.8 40.39,40.39 38.86,40.39 37.85,39.37 R20.1
WSLED1
  Top 0.508: 11.43,46.23 JP2.2
  Top 0.61: IC4.4 12.84,47.64 11.43,46.23
WSLED2
  Top 0.508: JP2.1 14.69,43.69 IC5.4
XTAL1_1
  Top 0.813: IC1.4 36.7,73.71 Y1.1
  Top 1.016: Y1.1 33.86,66.49 C2.1 R18.2
XTAL1_2
  Top 0.813: IC1.5 37.97,76.58 39.37,75.18 R3.1
XTAL2_1
  Top 0.61: U1.7 25.18,55.4 26.16,56.39 40.13,56.39 41.91,58.17 41.91,58.67 42.85,58.67 Y2.1
  Top 1.016: R4.2 C4.1 43.3,58.22 Y2.1
XTAL2_2
  Top 0.61: U1.8 24.38,56.79 25.25,57.66 R5.1

### Text on the board
bNames: RXD | TXD | GND | SR2019 | ENA | DIR | PUL | +5V | PUL | DIR | ENA | IN1 | IN2 | IN3 | PULL UP | IN4 | GND | PULL DOWN | +12V | LED1 | LED2 | RXD | TXD | PWR +5V | +12V | GND